# EAGLE schematic RDN (EAGLE 9.6.2)

## Sheet 1 of 3
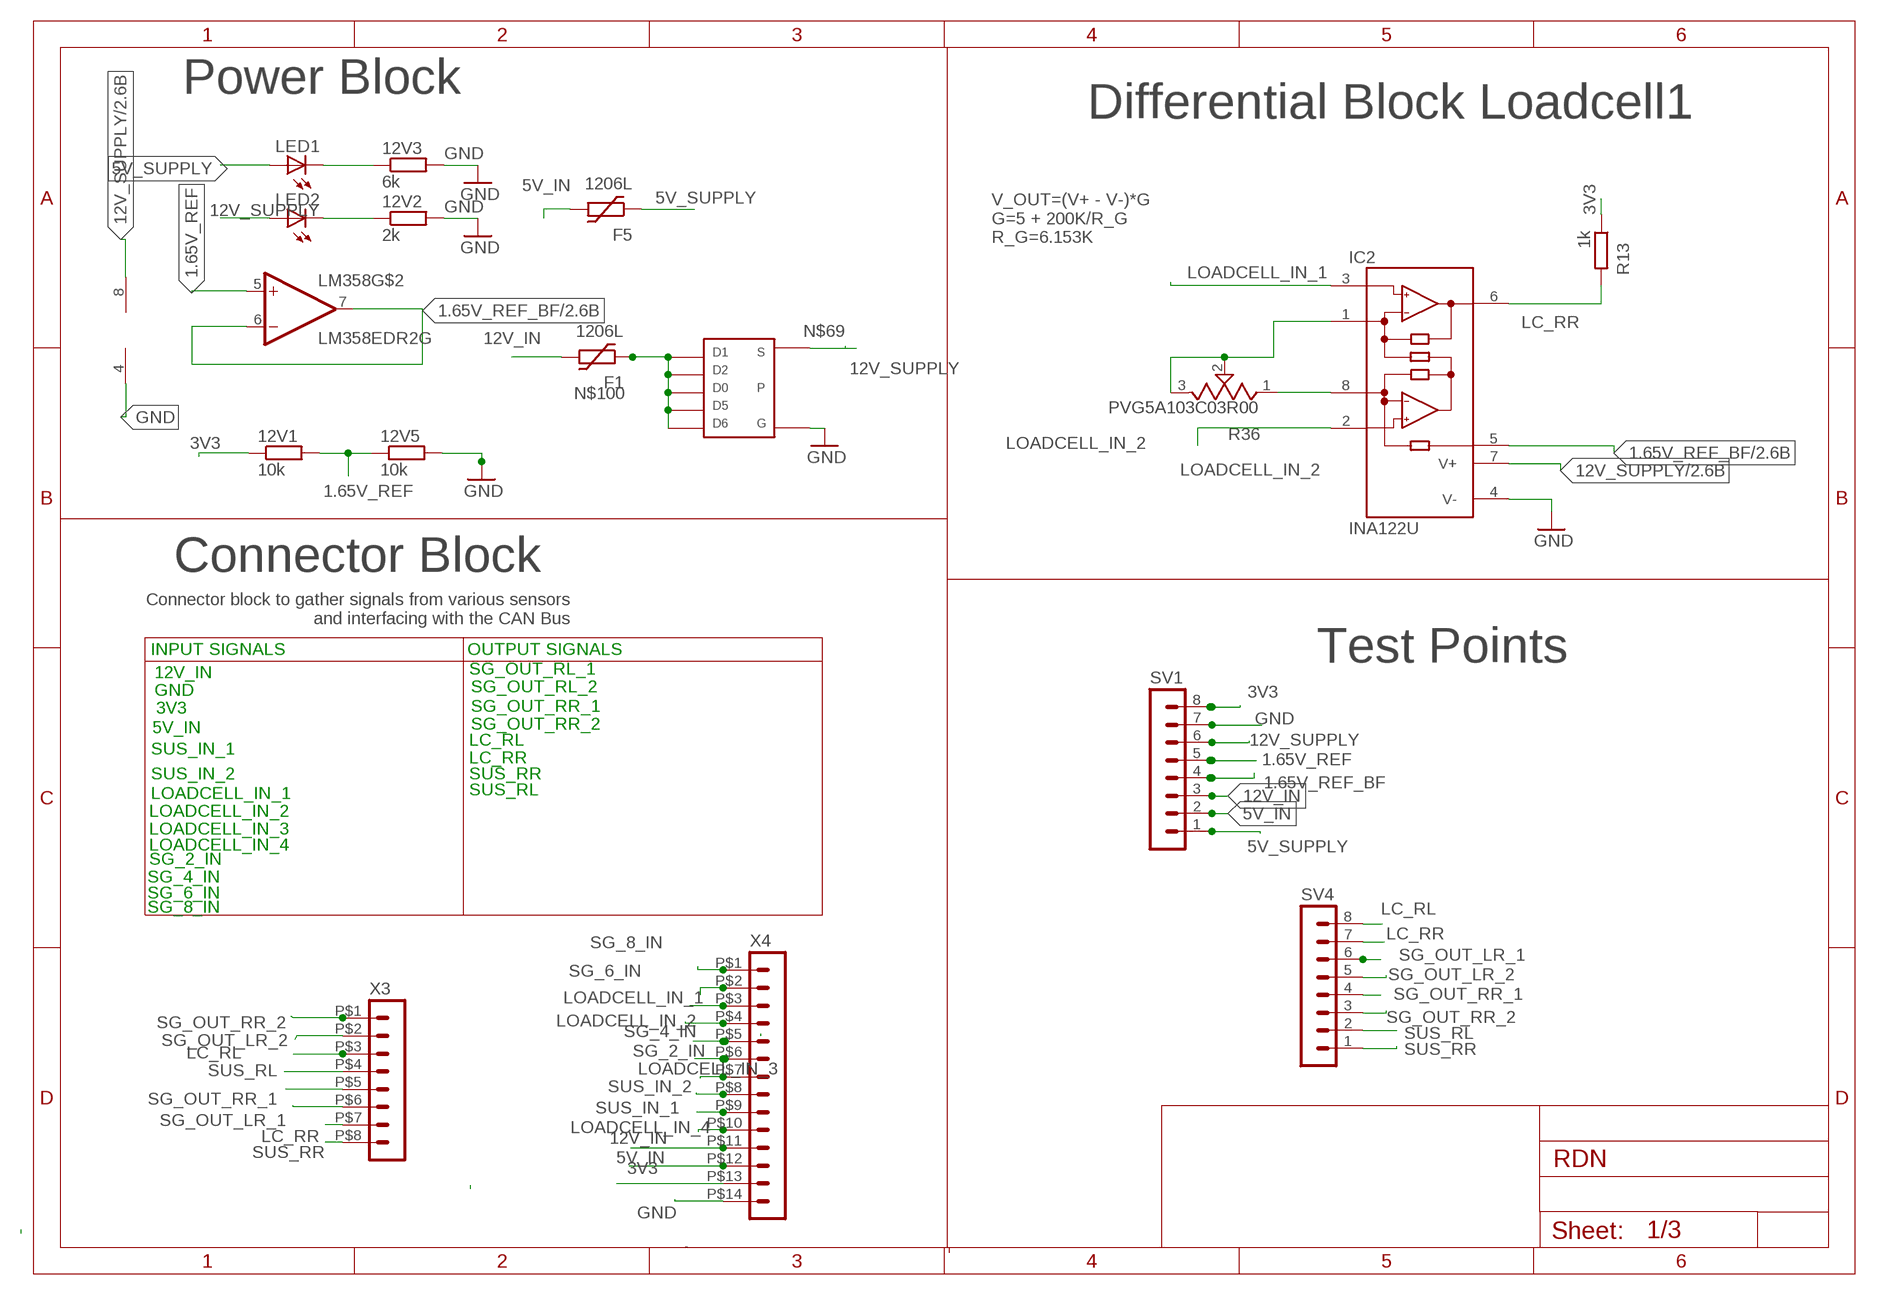
[diagram p0: schematic, sheet 1]

### Parts
12V1  10k  R-EU_R0805  [R0805]
12V2  2k  R-EU_R0805  [R0805]
12V3  6k  R-EU_R0805  [R0805]
12V5  10k  R-EU_R0805  [R0805]
F1  1206L  [1206L]
F5  1206L  [1206L]
IC2  INA122U  [SO08]
LED1  LEDCHIPLED_1206  [CHIPLED_1206]
LED2  LEDCHIPLED_1206  [CHIPLED_1206]
LM358  LM358EDR2G  [SOIC-8]
R13  1k  R-EU_R0805  [R0805]
R36  PVG5A103C03R00  [TRIM_PVG5A103C03R00]
SV1  MA08-1  [MA08-1]
SV4  MA08-1  [MA08-1]
U$1  TSOP-6_PMOS  [TSOP-6_PMOS]
X3  HEADER_POS8_44769-0801  [44769-0801]
X4  HEADER_POS14_44769-1401  [44769-1401]

### Nets
1.65V_REF: 12V1.2 12V5.1 LM358.5(+IN) SV1.5
1.65V_REF_BF: IC2.5(REF) LM358.6(-IN) LM358.7(OUT) SV1.4 ; also sheet 2,3
3V3: 12V1.1 R13.1 SV1.8 X4.P$13 ; also sheet 2,3
5V_IN: F5.P$2 SV1.2 X4.P$12
5V_SUPPLY: F5.P$1 LED1.A SV1.1 ; also sheet 3
12V_IN: F1.P$2 SV1.3 X4.P$11 ; also sheet 2
12V_SUPPLY: IC2.7(V+) LED2.A LM358.8(V+) SV1.6 U$1.S ; also sheet 2,3
GND: 12V2.2 12V3.2 12V5.2 IC2.4(V-) LM358.4(V-) SV1.7 U$1.G X4.P$14 ; also sheet 2,3
LC_RL: SV4.8 X3.P$3 ; also sheet 2
LC_RR: IC2.6(OUT) R13.2 SV4.7 X3.P$7
LOADCELL_IN_1: IC2.3(+IN) X4.P$3
LOADCELL_IN_2: IC2.2(-IN) X4.P$4
LOADCELL_IN_3: X4.P$7 ; also sheet 2
LOADCELL_IN_4: X4.P$10 ; also sheet 2
N$5: 12V2.1 LED2.C
N$6: IC2.1(RG) R36.2 R36.3
N$7: IC2.8(RG) R36.1
N$29: 12V3.1 LED1.C
N$100: F1.P$1 U$1.1 U$1.2 U$1.5 U$1.6 U$1.D(D0)
SG_2_IN: X4.P$6 ; also sheet 2,3
SG_4_IN: X4.P$5 ; also sheet 2,3
SG_6_IN: X4.P$2 ; also sheet 2,3
SG_8_IN: X4.P$1 ; also sheet 3
SG_OUT_LR_1: SV4.6 X3.P$6 ; also sheet 2
SG_OUT_LR_2: SV4.5 X3.P$2 ; also sheet 2
SG_OUT_RR_1: SV4.4 X3.P$5 ; also sheet 2
SG_OUT_RR_2: SV4.3 X3.P$1 ; also sheet 3
SUS_IN_1: X4.P$9 ; also sheet 3
SUS_IN_2: X4.P$8 ; also sheet 3
SUS_RL: SV4.2 X3.P$4 ; also sheet 3
SUS_RR: SV4.1 X3.P$8 ; also sheet 3
Unconnected: LM358.1(OUT) LM358.2(-IN) LM358.3(+IN)

### Notes on the sheet
- Power Block
- Differential Block Loadcell1
- V_OUT=(V+ - V-)*G
  G=5 + 200K/R_G
  R_G=6.153K
- Connector Block
- Connector block to gather signals from various sensors
   and interfacing with the CAN Bus
- INPUT SIGNALS | OUTPUT SIGNALS
- Test Points
- 12V_IN | SG_OUT_RL_1
- GND | SG_OUT_RL_2
- 3V3 | SG_OUT_RR_1
- 5V_IN | SG_OUT_RR_2
- LC_RL
- SUS_IN_1
- LC_RR
- SUS_IN_2 | SUS_RR
- LOADCELL_IN_1 | SUS_RL
- LOADCELL_IN_2
- LOADCELL_IN_3
- LOADCELL_IN_4
- SG_2_IN
- SG_4_IN
- SG_6_IN
- SG_8_IN

## Sheet 2 of 3
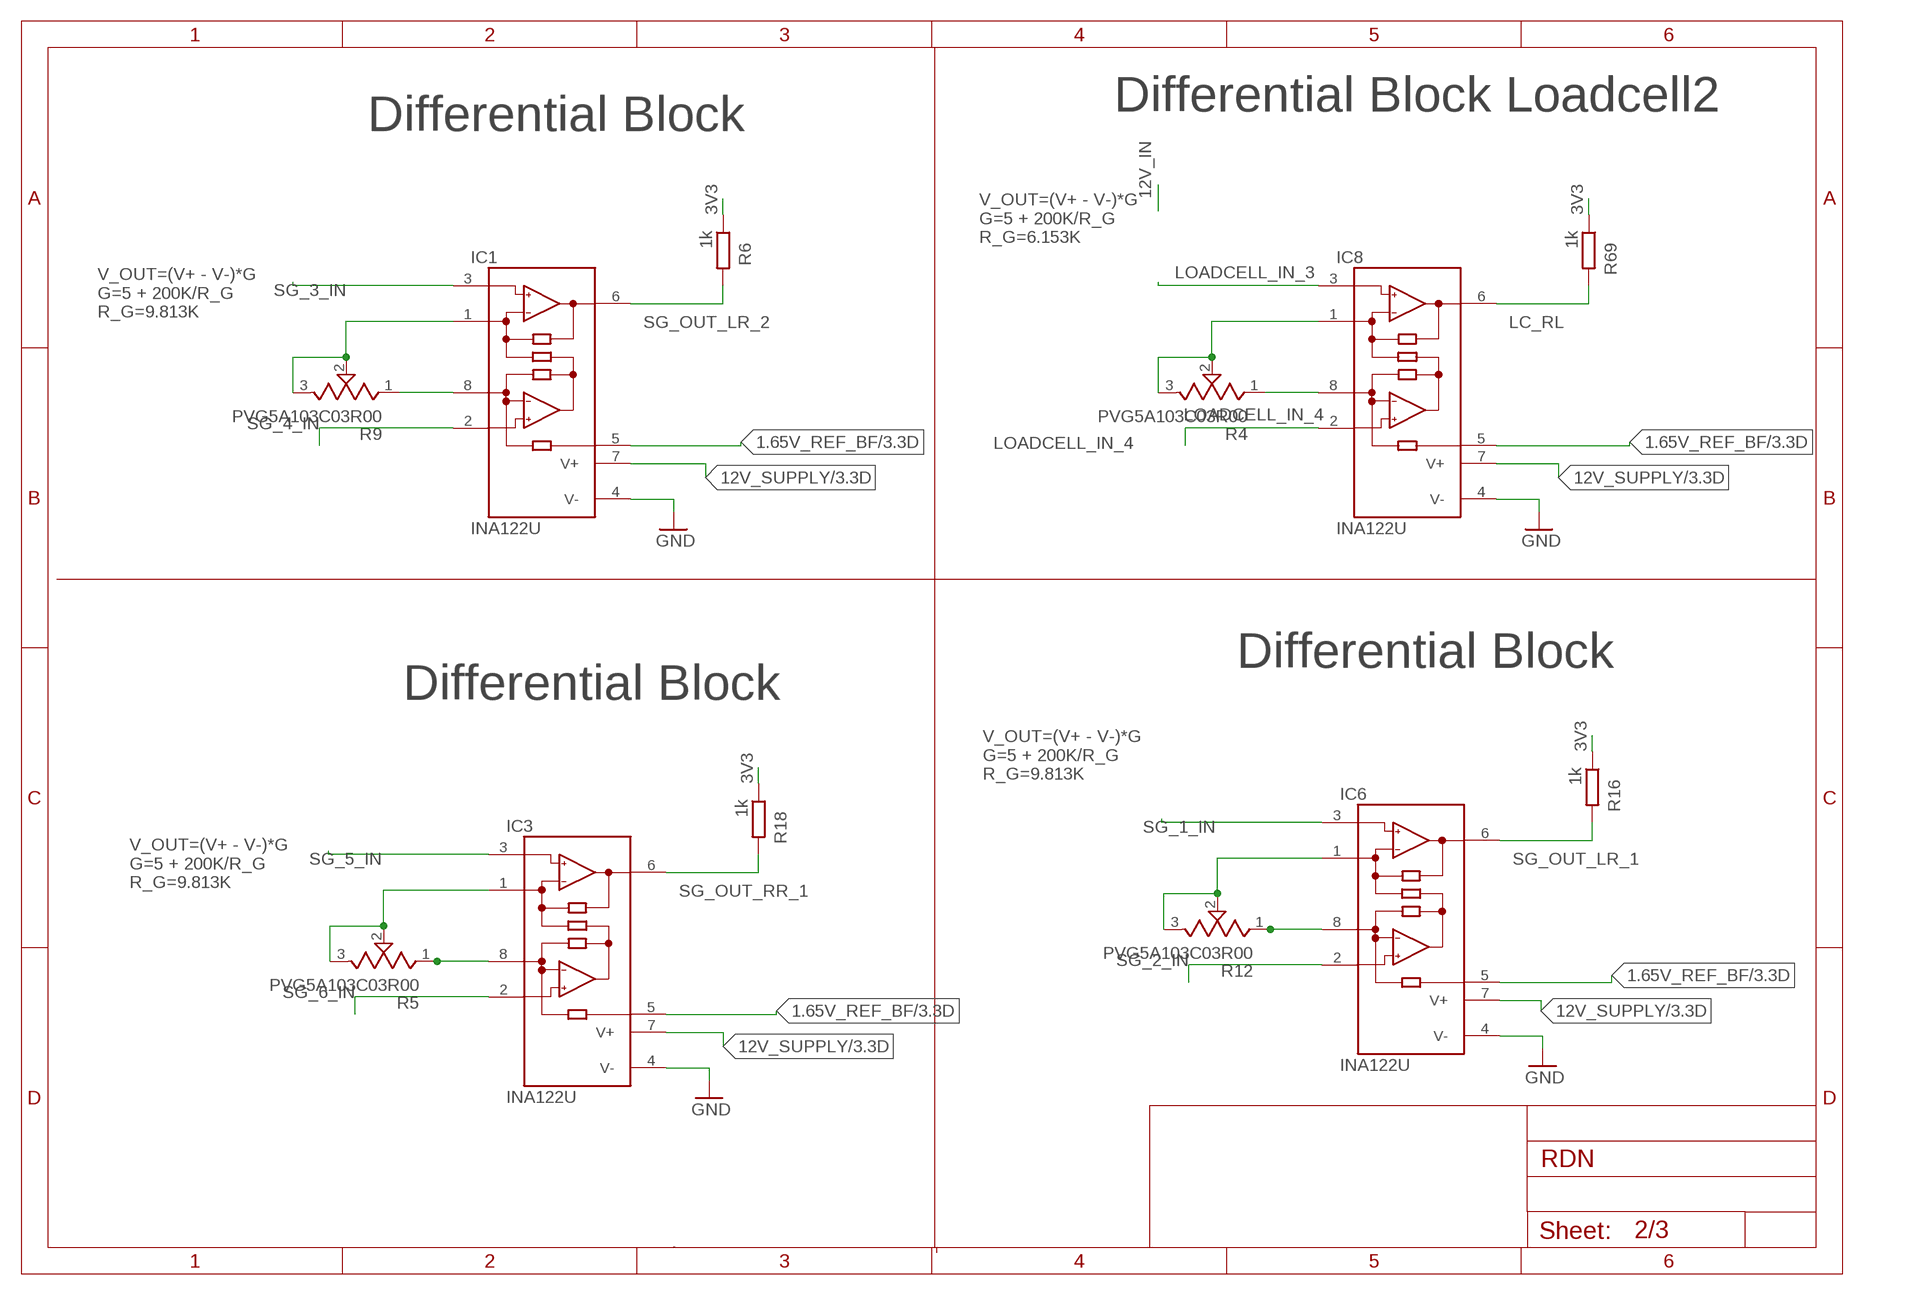
[diagram p1: schematic, sheet 2]

### Parts
IC1  INA122U  [SO08]
IC3  INA122U  [SO08]
IC6  INA122U  [SO08]
IC8  INA122U  [SO08]
R4  PVG5A103C03R00  [TRIM_PVG5A103C03R00]
R5  PVG5A103C03R00  [TRIM_PVG5A103C03R00]
R6  1k  R-EU_R0805  [R0805]
R9  PVG5A103C03R00  [TRIM_PVG5A103C03R00]
R12  PVG5A103C03R00  [TRIM_PVG5A103C03R00]
R16  1k  R-EU_R0805  [R0805]
R18  1k  R-EU_R0805  [R0805]
R69  1k  R-EU_R0805  [R0805]

### Nets
1.65V_REF_BF: IC1.5(REF) IC3.5(REF) IC6.5(REF) IC8.5(REF) ; also sheet 1,3
3V3: R6.1 R16.1 R18.1 R69.1 ; also sheet 1,3
12V_SUPPLY: IC1.7(V+) IC3.7(V+) IC6.7(V+) IC8.7(V+) ; also sheet 1,3
GND: IC1.4(V-) IC3.4(V-) IC6.4(V-) IC8.4(V-) ; also sheet 1,3
LC_RL: IC8.6(OUT) R69.2 ; also sheet 1
LOADCELL_IN_3: IC8.3(+IN) ; also sheet 1
LOADCELL_IN_4: IC8.2(-IN) ; also sheet 1
N$3: IC1.1(RG) R9.2 R9.3
N$4: IC1.8(RG) R9.1
N$12: IC3.1(RG) R5.2 R5.3
N$13: IC3.8(RG) R5.1
N$26: IC6.1(RG) R12.2 R12.3
N$27: IC6.8(RG) R12.1
N$42: IC8.1(RG) R4.2 R4.3
N$43: IC8.8(RG) R4.1
SG_1_IN: IC6.3(+IN) ; also sheet 3
SG_2_IN: IC6.2(-IN) ; also sheet 1,3
SG_3_IN: IC1.3(+IN) ; also sheet 3
SG_4_IN: IC1.2(-IN) ; also sheet 1,3
SG_5_IN: IC3.3(+IN) ; also sheet 3
SG_6_IN: IC3.2(-IN) ; also sheet 1,3
SG_OUT_LR_1: IC6.6(OUT) R16.2 ; also sheet 1
SG_OUT_LR_2: IC1.6(OUT) R6.2 ; also sheet 1
SG_OUT_RR_1: IC3.6(OUT) R18.2 ; also sheet 1

### Notes on the sheet
- Differential Block Loadcell2
- Differential Block
- V_OUT=(V+ - V-)*G
  G=5 + 200K/R_G
  R_G=6.153K
- V_OUT=(V+ - V-)*G
  G=5 + 200K/R_G
  R_G=9.813K
- Differential Block
- Differential Block
- V_OUT=(V+ - V-)*G
  G=5 + 200K/R_G
  R_G=9.813K
- V_OUT=(V+ - V-)*G
  G=5 + 200K/R_G
  R_G=9.813K

## Sheet 3 of 3
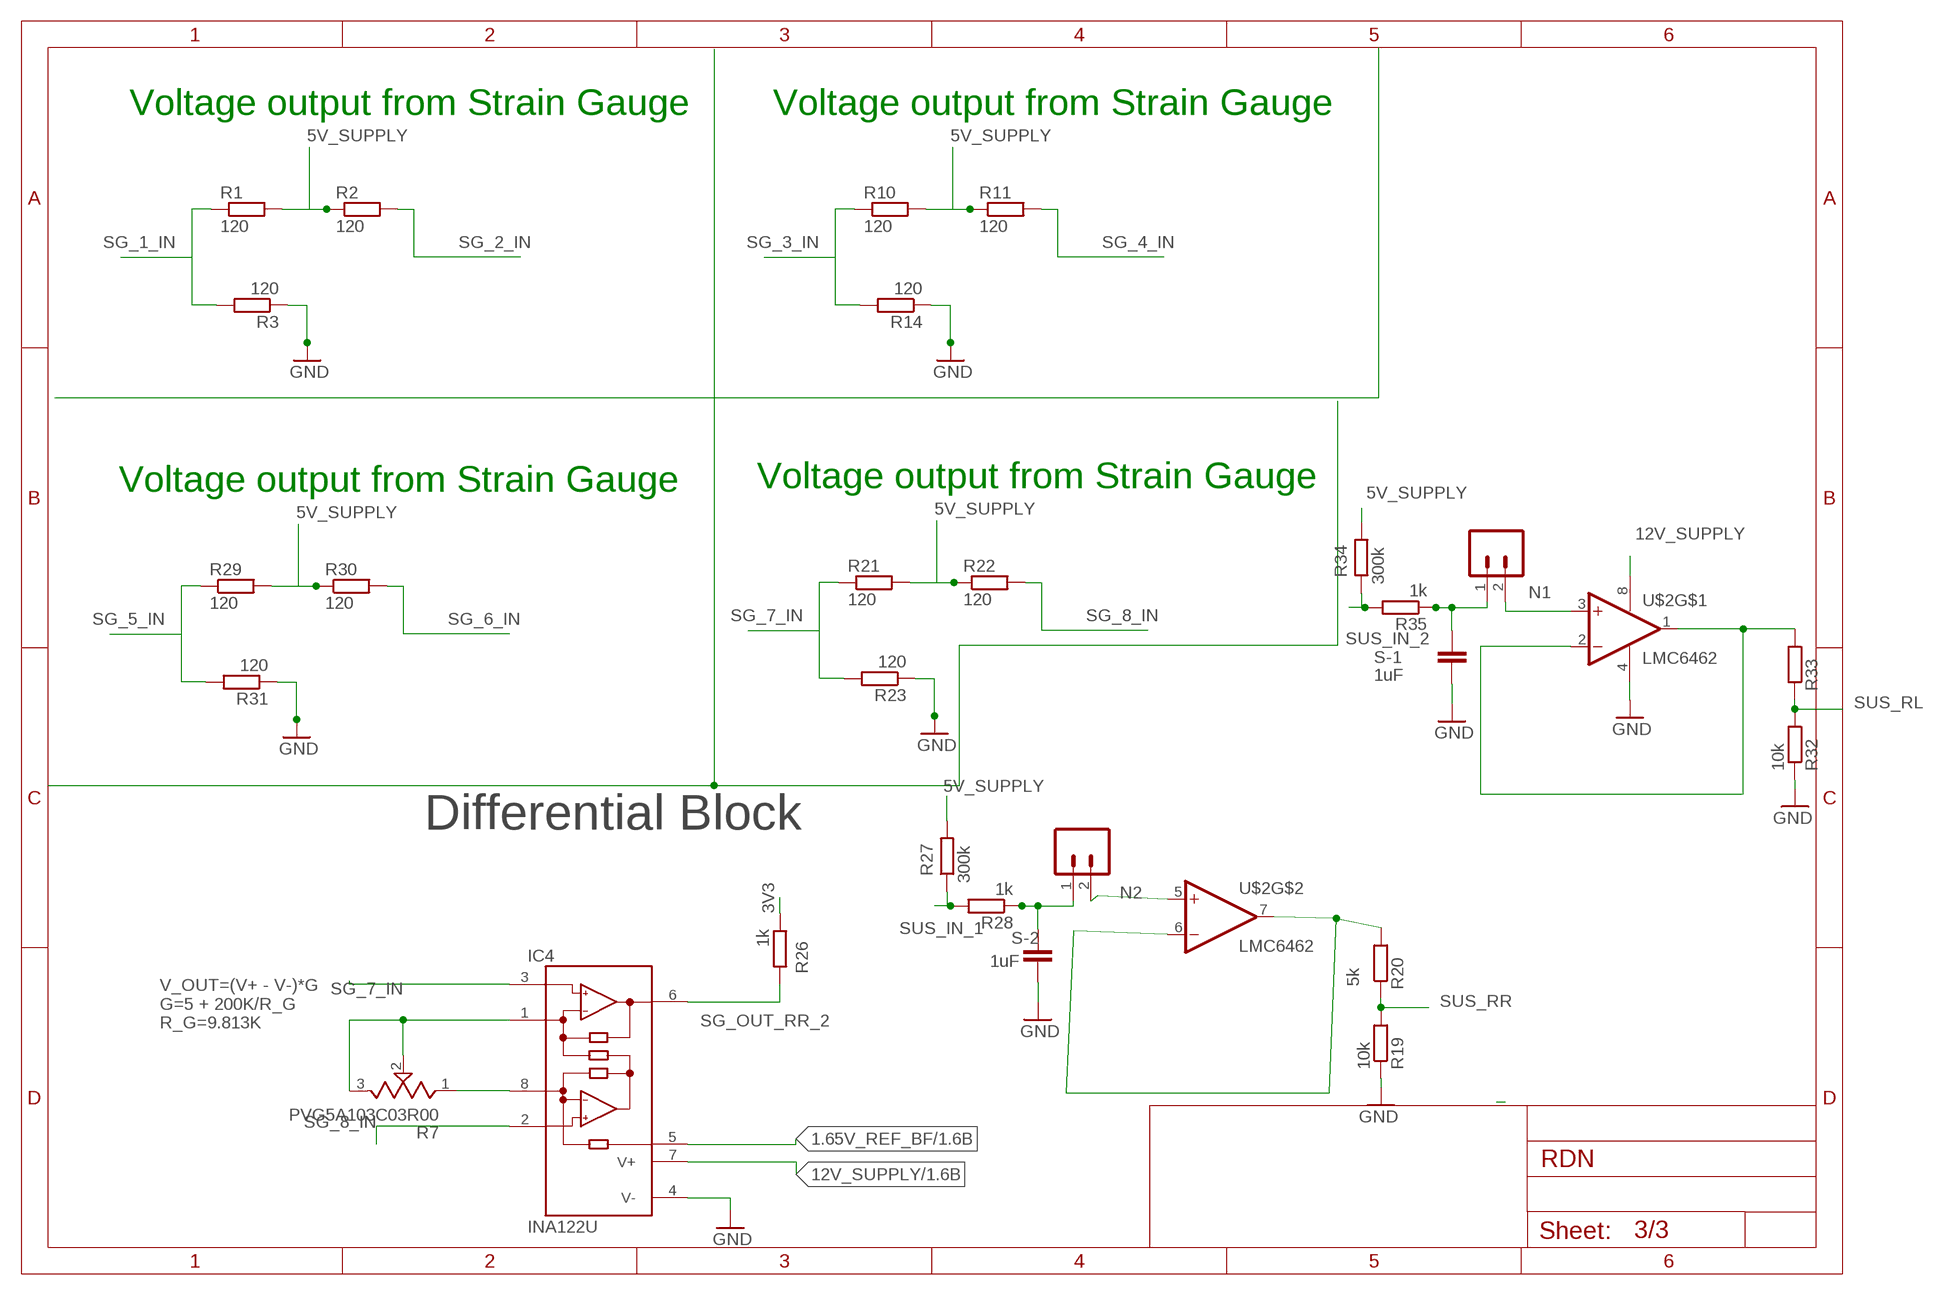
[diagram p2: schematic, sheet 3]

### Parts
IC4  INA122U  [SO08]
R1  120  R-EU_R0805  [R0805]
R2  120  R-EU_R0805  [R0805]
R3  120  R-EU_R0805  [R0805]
R7  PVG5A103C03R00  [TRIM_PVG5A103C03R00]
R10  120  R-EU_R0805  [R0805]
R11  120  R-EU_R0805  [R0805]
R14  120  R-EU_R0805  [R0805]
R19  10k  R-EU_R0805  [R0805]
R20  5k  R-EU_R0805  [R0805]
R21  120  R-EU_R0805  [R0805]
R22  120  R-EU_R0805  [R0805]
R23  120  R-EU_R0805  [R0805]
R26  1k  R-EU_R0805  [R0805]
R27  300k  R-EU_R0805  [R0805]
R28  1k  R-EU_R0805  [R0805]
R29  120  R-EU_R0805  [R0805]
R30  120  R-EU_R0805  [R0805]
R31  120  R-EU_R0805  [R0805]
R32  10k  R-EU_R0805  [R0805]
R33  5k  R-EU_R0805  [R0805]
R34  300k  R-EU_R0805  [R0805]
R35  1k  R-EU_R0805  [R0805]
S-1  1uF  C-EUC0805  [C0805]
S-2  1uF  C-EUC0805  [C0805]
STEERING_JP  STEERING_JP  CONN_02  [1X02]
STEERING_JP1  STEERING_JP  CONN_02  [1X02]
U$2  LMC6462  [S08]

### Nets
1.65V_REF_BF: IC4.5(REF) ; also sheet 1,2
3V3: R26.1 ; also sheet 1,2
5V_SUPPLY: R1.2 R2.1 R10.2 R11.1 R21.2 R22.1 R27.2 R29.2 R30.1 R34.2 ; also sheet 1
12V_SUPPLY: IC4.7(V+) U$2.8(V+) ; also sheet 1,2
GND: IC4.4(V-) R3.1 R14.1 R19.1 R23.1 R31.1 R32.1 S-1.2 S-2.2 U$2.4(V-) ; also sheet 1,2
N1: STEERING_JP1.2 U$2.3(+IN)
N2: STEERING_JP.2 U$2.5(+IN)
N$15: R20.2 U$2.6(-IN) U$2.7(OUT)
N$16: R28.1 S-2.1 STEERING_JP.1
N$17: IC4.1(RG) R7.2 R7.3
N$18: IC4.8(RG) R7.1
N$20: R33.2 U$2.1(OUT) U$2.2(-IN)
N$21: R35.1 S-1.1 STEERING_JP1.1
SG_1_IN: R1.1 R3.2 ; also sheet 2
SG_2_IN: R2.2 ; also sheet 1,2
SG_3_IN: R10.1 R14.2 ; also sheet 2
SG_4_IN: R11.2 ; also sheet 1,2
SG_5_IN: R29.1 R31.2 ; also sheet 2
SG_6_IN: R30.2 ; also sheet 1,2
SG_7_IN: IC4.3(+IN) R21.1 R23.2
SG_8_IN: IC4.2(-IN) R22.2 ; also sheet 1
SG_OUT_RR_2: IC4.6(OUT) R26.2 ; also sheet 1
SUS_IN_1: R27.1 R28.2 ; also sheet 1
SUS_IN_2: R34.1 R35.2 ; also sheet 1
SUS_RL: R32.2 R33.1 ; also sheet 1
SUS_RR: R19.2 R20.1 ; also sheet 1

### Notes on the sheet
- Voltage output from Strain Gauge | Voltage output from Strain Gauge
- Voltage output from Strain Gauge | Voltage output from Strain Gauge
- Differential Block
- V_OUT=(V+ - V-)*G
  G=5 + 200K/R_G
  R_G=9.813K

## Library data of the parts
12V1-12V3 12V5 R1-R3 R10 R11 R14 R21-R23 R29-R31 = rcl:R-EU_: RESISTOR, European symbol; SPICEPREFIX: R
F1 F5 = IIT_BOMBAY_Racing:1206L
IC1-IC4 IC6 IC8 = burr-brown:INA122: Instrumentation Amplifier Single Supply, MicroPower; MPN: INA122U; OC_FARNELL: 1212407; OC_NEWARK: 97K1918
LED1 = led:LED: LED OSRAM: - CHIPLED LG R971, LG N971, LY N971, LG Q971, LY Q971, LO R971, LY R971 LH N974, LH R974 LS Q976, LO Q976, LY Q976 LO Q996 - Hyper CHIPLED LW Q18S LB Q993, LB Q99A, LB R99A - SideLED LS A670, LO A670, LY A670, LG A670, LP A670 LB A673, LV A673, LT A673, LW A673 LH A674 LY A675 LS A676, LA A676, LO A676, LY A676, LW A676 LS A679, LY A679, LG A679 - Hyper Micro SIDELED® LS Y876, LA Y876, LO Y876, LY Y876 LT Y87S - SmartLED LW L88C, LW L88S LB L89C, LB L89S, LG L890 LS L89K, LO L89K, LY L89K LS L896, LA L896, LO L896, LY L896 - TOPLED LS T670, LO T670, LY T670, LG T670, LP T670 LSG T670, LSP T670, LSY T670, LOP T670, LYG T670 LG T671, LOG T671, LSG T671 LB T673, LV T673, LT T673, LW T673 LH T674 LS T676, LA T676, LO T676, LY T676, LB T676, LH T676, LSB T676, LW T676 LB T67C, LV T67C, LT T67C, LS T67K, LO T67K, LY T67K, LW E67C LS E67B, LA E67B, LO E67B, LY E67B, LB E67C, LV E67C, LT E67C LW T67C LS T679, LY T679, LG T679 LS T770, LO T770, LY T770, LG T770, LP T770 LB T773, LV T773, LT T773, LW T773 LH T774 LS E675, LA E675, LY E675, LS T675 LS T776, LA T776, LO T776, LY T776, LB T776 LHGB T686 LT T68C, LB T68C - Hyper Mini TOPLED® LB M676 - Mini TOPLED Santana® LG M470 LS M47K, LO M47K, LY M47K Source: http://www.osram.convergy.de LUXEON: - LUMILED® LXK2-PW12-R00, LXK2-PW12-S00, LXK2-PW14-U00, LXK2-PW14-V00 LXK2-PM12-R00, LXK2-PM12-S00, LXK2-PM14-U00 LXK2-PE12-Q00, LXK2-PE12-R00, LXK2-PE12-S00, LXK2-PE14-T00, LXK2-PE14-U00 LXK2-PB12-K00, LXK2-PB12-L00, LXK2-PB12-M00, LXK2-PB14-N00, LXK2-PB14-P00, LXK2-PB14-Q00 LXK2-PR12-L00, LXK2-PR12-M00, LXK2-PR14-Q00, LXK2-PR14-R00 LXK2-PD12-Q00, LXK2-PD12-R00, LXK2-PD12-S00 LXK2-PH12-R00, LXK2-PH12-S00 LXK2-PL12-P00, LXK2-PL12-Q00, LXK2-PL12-R00 Source: www.luxeon.com KINGBRIGHT: KA-3528ASYC Source: www.kingbright.com
LED2 = led:LED: LED OSRAM: - CHIPLED LG R971, LG N971, LY N971, LG Q971, LY Q971, LO R971, LY R971 LH N974, LH R974 LS Q976, LO Q976, LY Q976 LO Q996 - Hyper CHIPLED LW Q18S LB Q993, LB Q99A, LB R99A - SideLED LS A670, LO A670, LY A670, LG A670, LP A670 LB A673, LV A673, LT A673, LW A673 LH A674 LY A675 LS A676, LA A676, LO A676, LY A676, LW A676 LS A679, LY A679, LG A679 - Hyper Micro SIDELED® LS Y876, LA Y876, LO Y876, LY Y876 LT Y87S - SmartLED LW L88C, LW L88S LB L89C, LB L89S, LG L890 LS L89K, LO L89K, LY L89K LS L896, LA L896, LO L896, LY L896 - TOPLED LS T670, LO T670, LY T670, LG T670, LP T670 LSG T670, LSP T670, LSY T670, LOP T670, LYG T670 LG T671, LOG T671, LSG T671 LB T673, LV T673, LT T673, LW T673 LH T674 LS T676, LA T676, LO T676, LY T676, LB T676, LH T676, LSB T676, LW T676 LB T67C, LV T67C, LT T67C, LS T67K, LO T67K, LY T67K, LW E67C LS E67B, LA E67B, LO E67B, LY E67B, LB E67C, LV E67C, LT E67C LW T67C LS T679, LY T679, LG T679 LS T770, LO T770, LY T770, LG T770, LP T770 LB T773, LV T773, LT T773, LW T773 LH T774 LS E675, LA E675, LY E675, LS T675 LS T776, LA T776, LO T776, LY T776, LB T776 LHGB T686 LT T68C, LB T68C - Hyper Mini TOPLED® LB M676 - Mini TOPLED Santana® LG M470 LS M47K, LO M47K, LY M47K Source: http://www.osram.convergy.de LUXEON: - LUMILED® LXK2-PW12-R00, LXK2-PW12-S00, LXK2-PW14-U00, LXK2-PW14-V00 LXK2-PM12-R00, LXK2-PM12-S00, LXK2-PM14-U00 LXK2-PE12-Q00, LXK2-PE12-R00, LXK2-PE12-S00, LXK2-PE14-T00, LXK2-PE14-U00 LXK2-PB12-K00, LXK2-PB12-L00, LXK2-PB12-M00, LXK2-PB14-N00, LXK2-PB14-P00, LXK2-PB14-Q00 LXK2-PR12-L00, LXK2-PR12-M00, LXK2-PR14-Q00, LXK2-PR14-R00 LXK2-PD12-Q00, LXK2-PD12-R00, LXK2-PD12-S00 LXK2-PH12-R00, LXK2-PH12-S00 LXK2-PL12-P00, LXK2-PL12-Q00, LXK2-PL12-R00 Source: www.luxeon.com KINGBRIGHT: KA-3528ASYC Source: www.kingbright.com; SPICEPREFIX: L
LM358 = IIT_BOMBAY_Racing2:LM358EDR2G
R4 R5 R7 R9 R12 R36 = PVG5A103C03R00:PVG5A103C03R00: 1 kOhms 0.25W, 1/4W J Lead Surface Mount Trimmer Potentiometer Cermet 11 Turn Top Adjustment Check availability <https://pricing.snapeda.com/parts/PVG5A103C03R00/Bourns/view-part?ref=eda>; AVAILABILITY: In Stock; CHECK_PRICES: https://www.snapeda.com/parts/PVG5A103C03R00/Bourns/view-part/?ref=eda; DESCRIPTION: 10 kOhms 0.25W, 1/4W J Lead Surface Mount Trimmer Potentiometer Cermet 11.0 Turn Top Adjustment; MF: Bourns; MP: PVG5A103C03R00; PACKAGE: SMD-3 Bourns; PRICE: None; SNAPEDA_LINK: https://www.snapeda.com/parts/PVG5A103C03R00/Bourns/view-part/?ref=snap
R6 R13 R16 R18 R26 R69 = IIT_BOMBAY_Racing:R-EU_: RESISTOR, European symbol
R19 R20 R27 R28 R32-R35 = IIT_BOMBAY_Racing2:R-EU_: RESISTOR, European symbol
S-1 S-2 = IIT_BOMBAY_Racing:C-EU: CAPACITOR, European symbol
STEERING_JP STEERING_JP1 = IIT_BOMBAY_Racing2:CONN_02: Multi connection point. Often used as Generic Header-pin footprint for 0.1 inch spaced/style header connections On any of the 0.1 inch spaced packages, you can populate with these: Break Away Headers - Straight <https://www.sparkfun.com/products/116> (PRT-00116) Break Away Male Headers - Right Angle <https://www.sparkfun.com/products/553> (PRT-00553) Female Headers <https://www.sparkfun.com/products/115> (PRT-00115) Break Away Headers - Machine Pin <https://www.sparkfun.com/products/117> (PRT-00117) Break Away Female Headers - Swiss Machine Pin <https://www.sparkfun.com/products/743> (PRT-00743) For SCREWTERMINALS and SPRING TERMINALS visit here: Screw Terimnals on SparkFun.com <https://www.sparkfun.com/search/results?term=Screw+Terminals> (5mm/3.5mm/2.54mm spacing) This device is also useful as a general connection point to wire up your design to another part of your project. Our various solder wires solder well into these plated through hole pads. Hook-Up Wire - Assortment (Stranded, 22 AWG) <https://www.sparkfun.com/products/11375> (PRT-11375) Hook-Up Wire - Assortment (Solid Core, 22 AWG) <https://www.sparkfun.com/products/11367> (PRT-11367) View the entire wire category on our website here <https://www.sparkfun.com/categories/141> Special notes: Molex polarized connector foot print use with: PRT-08233 with associated crimp pins and housings. 2.54_SCREWTERM for use with PRT-10571. 3.5mm Screw Terminal footprints for PRT-08084 5mm Screw Terminal footprints for use with PRT-08432
SV1 SV4 = con-lstb:MA08-1: PIN HEADER; OC_FARNELL: unknown; OC_NEWARK: unknown
U$1 = TSOP-6_MOS:TSOP-6_PMOS
U$2 = IIT_BOMBAY_Racing (1):LMC6462
X3 = IIT_BOMBAY_Racing2 (1):HEADER_POS8_?: Molex - Micro-Fit 3.0 Series connector, 3.00mm (0.118") pitch header, 8 positions.
X4 = IIT_BOMBAY_Racing2 (1):HEADER_POS14_?: Molex - Micro-Fit 3.0 Series connector, 3.00mm (0.118") pitch header, 14 positions.